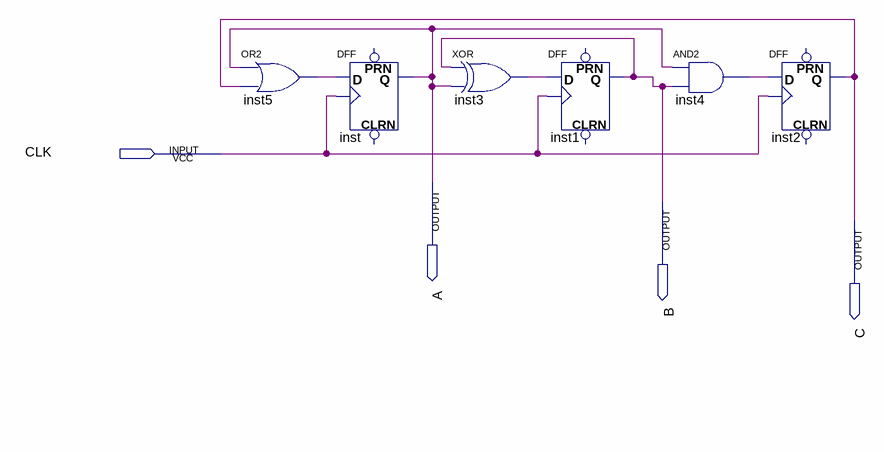
[diagram p0: schematic sheet]
// Quartus schematic 5_counter.bdf as structural Verilog: 6 symbols, 4 pins
module \5_counter  (
  input  CLK,
  output A,
  output B,
  output C
);

  wire inst3_out, inst4_out, inst5_out;

  or inst5 (inst5_out, A, C);
  DFF inst (.CLK(CLK), .D(inst5_out), .Q(A));  // open: CLRN, PRN
  xor inst3 (inst3_out, B, A);
  DFF inst1 (.CLK(CLK), .D(inst3_out), .Q(B));  // open: CLRN, PRN
  and inst4 (inst4_out, A, B);
  DFF inst2 (.CLK(CLK), .D(inst4_out), .Q(C));  // open: CLRN, PRN
endmodule
